# Altium schematic sheet SWITCHING_OLD.SchDoc
size A4; SheetNumber: 3; SheetTotal: 6
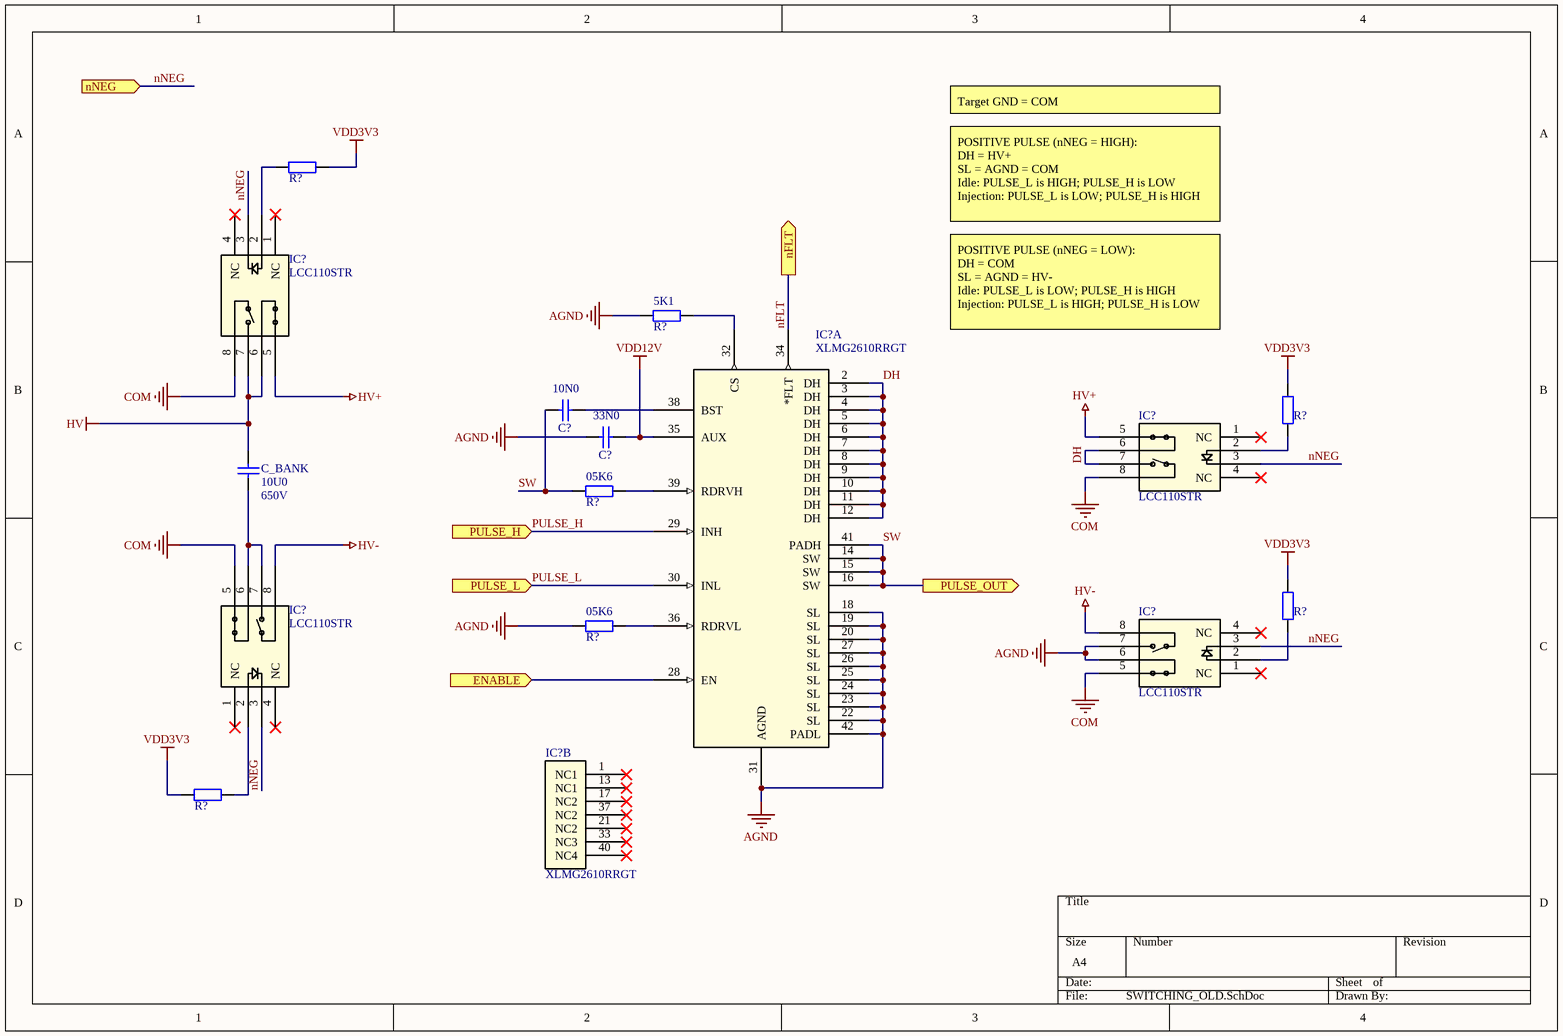
[diagram p0: SWITCHING_OLD.SchDoc]

## Parts
(Parts that share a designator on the sheet are numbered #1, #2 ... from top to bottom, then left to right.)
C?#1  VALUE_4C: 10N0  [CAPC0603N]  (hidden comment: Cap)
C?#2  VALUE_4C: 33N0  [CAPC0603N]  (hidden comment: Cap)
C_BANK  VALUE_4C: 10U0  VOLTAGE: 650V  [CAP_TH_15MM_RADIAL_30X58MM]  (hidden comment: Cap)
IC?#1  LCC110STR  [SOP254P952X457-8N]
IC?#2  LCC110STR  [SOP254P952X457-8N]
IC?#3  XLMG2610RRGT  [XLMG2610RRGT]  (part A of 2)
IC?#4  LCC110STR  [SOP254P952X457-8N]
IC?#5  LCC110STR  [SOP254P952X457-8N]
IC?#6  XLMG2610RRGT  [XLMG2610RRGT]  (part B of 2)
R?#1  Res  [RESC0603N]  (value not drawn)
R?#2  value 5K1  [RESC0603N]  (hidden comment: Res)
R?#3  Res  [RESC0603N]  (value not drawn)
R?#4  VALUE_4C: 05K6  [RESC0603N]  (hidden comment: Res)
R?#5  VALUE_4C: 05K6  [RESC0603N]  (hidden comment: Res)
R?#6  Res  [RESC0603N]  (value not drawn)
R?#7  Res  [RESC0603N]  (value not drawn)

## Ports
ENABLE (in), nFLT (out), nNEG (in), PULSE_H (in), PULSE_L (in), PULSE_OUT (out)

## Nets
AGND: C?#2.1 IC?#3.18(SL) IC?#3.19(SL) IC?#3.20(SL) IC?#3.22(SL) IC?#3.23(SL) IC?#3.24(SL) IC?#3.25(SL) IC?#3.26(SL) IC?#3.27(SL) IC?#3.31(AGND) IC?#3.42(PADL) IC?#5.6(NOCL2) IC?#5.7(NOOP1) R?#2.1 R?#5.1
COM: IC?#1.8(NOOP2) IC?#2.8(NOOP2) IC?#4.5(NOCL1) IC?#5.5(NOCL1)
HV: C_BANK.2 IC?#1.6(NOCL2) IC?#1.7(NOOP1)
HV+: IC?#1.5(NOCL1) IC?#2.5(NOCL1)
HV-: IC?#4.8(NOOP2) IC?#5.8(NOOP2)
VDD3V3: R?#1.2 R?#3.2 R?#6.2 R?#7.2
VDD12V: C?#2.2 IC?#3.35(AUX)
DH: IC?#2.6(NOCL2) IC?#2.7(NOOP1) IC?#3.2(DH) IC?#3.3(DH) IC?#3.4(DH) IC?#3.5(DH) IC?#3.6(DH) IC?#3.7(DH) IC?#3.8(DH) IC?#3.9(DH) IC?#3.10(DH) IC?#3.11(DH) IC?#3.12(DH)
ENABLE: IC?#3.28(EN) ; port ENABLE
nFLT: IC?#3.34(*FLT) ; port nFLT
nNEG: IC?#1.3(-) IC?#2.3(-) IC?#4.3(-) IC?#5.3(-) ; port nNEG
PULSE_H: IC?#3.29(INH) ; port PULSE_H
PULSE_L: IC?#3.30(INL) ; port PULSE_L
SW: C?#1.1 IC?#3.14(SW) IC?#3.15(SW) IC?#3.16(SW) IC?#3.41(PADH) R?#4.1 ; port PULSE_OUT
NetC?#1_2: C?#1.2 IC?#3.38(BST)
NetC_BANK_1: C_BANK.1 IC?#4.6(NOCL2) IC?#4.7(NOOP1)
NetIC?#1_2: IC?#1.2(+) R?#1.1
NetIC?#2_2: IC?#2.2(+) R?#3.1
NetIC?#3_32: IC?#3.32(CS) R?#2.2
NetIC?#3_36: IC?#3.36(RDRVL) R?#5.2
NetIC?#3_39: IC?#3.39(RDRVH) R?#4.2
NetIC?#4_2: IC?#4.2(+) R?#7.1
NetIC?#5_2: IC?#5.2(+) R?#6.1

Not connected (* = marked no-connect by the designer): IC?#1 1(NC)* 4(NC)*; IC?#2 1(NC)* 4(NC)*; IC?#4 1(NC)* 4(NC)*; IC?#5 1(NC)* 4(NC)*; IC?#6 1(NC1)* 13(NC1)* 17(NC2)* 21(NC2)* 33(NC3)* 37(NC2)* 40(NC4)*

## Notes on the sheet
- Target GND = COM
- POSITIVE PULSE (nNEG = HIGH):
  DH = HV+
  SL = AGND = COM
  Idle: PULSE_L is HIGH; PULSE_H is LOW
  Injection: PULSE_L is LOW; PULSE_H is HIGH
- POSITIVE PULSE (nNEG = LOW):
  DH = COM
  SL = AGND = HV-
  Idle: PULSE_L is LOW; PULSE_H is HIGH
  Injection: PULSE_L is HIGH; PULSE_H is LOW

## Library data of the parts
C?#1 = CGA3E2C0G1H103J080AA: MANUF: TDK; DESCR: CAP 10N0 0603 50V NP0 5%; VENDOR: FARNELL INONE; VENDORCODE: 2210846; POPULATE: YES; VALUE_PF: 10000; VALUE: 10N; VOLTAGE: 50V; TOLERANCE: 0.05; MANUFCODE: CGA3E2C0G1H103J080AA; PACKAGE: 0603; TECHNOLOGY: NP0
C?#2 = CL10B333KB8NFNC: MANUF: SAMSUNG; DESCR: CAP 33N0 0603 50V X7R 10%; VENDOR: DIGI-KEY; VENDORCODE: 1276-2040-1-ND; POPULATE: YES; VALUE: 33N; VOLTAGE: 50V; TOLERANCE: 0.1; MANUFCODE: CL10B333KB8NFNC; PACKAGE: 0603; TECHNOLOGY: X7R
C_BANK = B32928A4106K000: MANUF: EPCOS; DESCR: CAP 10U 30X58 650V PP 10%; VENDOR: MOUSER; VENDORCODE: 871-B32928A4106K000; POPULATE: YES; VALUE_PF: 10000000; VALUE: 10U; TOLERANCE: 0.1; MANUFCODE: B32928A4106K000; PACKAGE: 30X58
IC?#1 IC?#2 IC?#4 IC?#5 = LCC110STR: MANUF: IXYS; DESCR: IC SSR SPDT 350V 120mA; VENDOR: MOUSER; VENDORCODE: 849-LCC110STR; MANUFCODE: LCC110STR
IC?#3 IC?#6 = XLMG2610RRGT: MANUF: TEXAS INSTRUMENTS; DESCR: IC INT HALF BRIDGE GAN; VENDOR: MOUSER; VENDORCODE: 595-LMG2610RRGT; POPULATE: YES; MANUFCODE: XLMG2610RRGT
R?#1 R?#3 R?#6 R?#7 = MC 0.063W 0603 1% 39R: Resistor; MANUF: MULTICOMP; DESCR: RES 39R0 0603 0.063W 1% 50V 200PPM; POPULATE: YES; VALUE_MOHM: 39000; VALUE: 39R; VALUE_4C: 39R0; POWER: 0.063W; TOLERANCE: 1%; VOLTAGE: 50V; TEMPCOEFF: 200PPM; NPOWER: 0.063; NTOLERANCE: 0.01; NVOLTAGE: 50; NTEMPCOEFF: 200; MANUFCODE: MC 0.063W 0603 1% 39R; PACKAGE: 0603; NVALUE: 39000
R?#2 = MC 0.063W 0603 1% 5K1: Resistor; MANUF: MULTICOMP; DESCR: RES 05K1 0603 0.063W 1% 50V 100PPM; VENDOR: FARNELL INONE; VENDORCODE: 9331301; POPULATE: YES; VALUE_MOHM: 5100000; VALUE_4C: 05K1; POWER: 0.063W; TOLERANCE: 1%; VOLTAGE: 50V; TEMPCOEFF: 100PPM; NPOWER: 0.063; NTOLERANCE: 0.01; NVOLTAGE: 50; NTEMPCOEFF: 100; MANUFCODE: MC 0.063W 0603 1% 5K1; PACKAGE: 0603; NVALUE: 5100000
R?#4 R?#5 = MC 0.063W 0603 1% 5K6: Resistor; MANUF: MULTICOMP; DESCR: RES 05K6 0603 0.063W 1% 50V 100PPM; VENDOR: FARNELL INONE; VENDORCODE: 9331352; POPULATE: YES; VALUE_MOHM: 5600000; VALUE: 5K6; POWER: 0.063W; TOLERANCE: 1%; VOLTAGE: 50V; TEMPCOEFF: 100PPM; NPOWER: 0.063; NTOLERANCE: 0.01; NVOLTAGE: 50; NTEMPCOEFF: 100; MANUFCODE: MC 0.063W 0603 1% 5K6; PACKAGE: 0603; NVALUE: 5600000